# Altium schematic sheet M8_Y-adapter.SchDoc: =project_title
size Tabloid; PageSetup: Record=PageOptions|CenterHorizontal=True|CenterVertical=True|PrintScale=0.73|XCorrection=1.00|YCorrection=1.00|PrintKind=0|BorderSize=5000000|LeftOffset=0|BottomOffset=0|Orientation=2|PaperLength=1000|PaperWidth=1000|Scale=100|PaperSource=7|PrintQuality=-4|MediaType=1|DitherType=10|PaperKind=A4|PrintScaleMode=1; CompanyName: Luxonis Holding; Organization: Luxonis Holding; Address1: 1925 Harmony Park Drive; Address2: Westminster, CO; Address3: 80234; Address4: United States; SheetNumber: 2; SheetTotal: 3
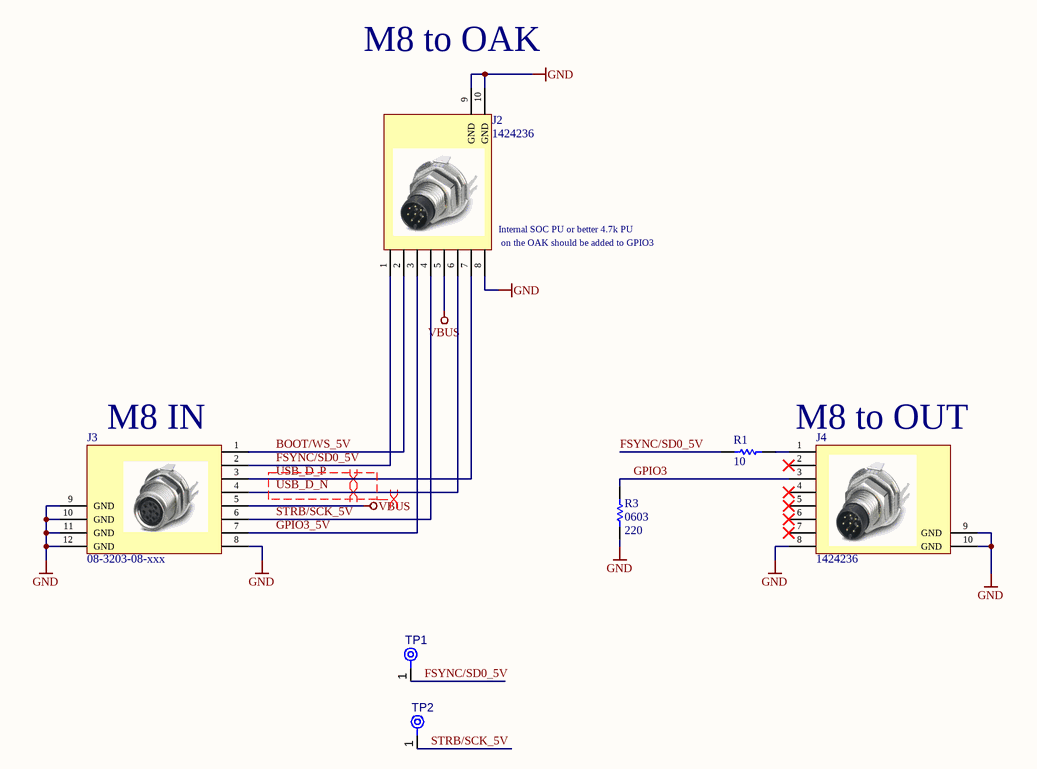
[diagram p0: M8_Y-adapter.SchDoc]

## Parts
J2  1424236  [1424236]
J3  08-3203-08-xxx  [08-3203-08-XXX]
J4  1424236  [1424236]
R1  value 10  [RESC0603(1608)_N]  (hidden comment: CRCW060310R0FKEA)
R3  value 220  Case/Package: 0603  [RESC0603(1608)_L]  (hidden comment: RC0603FR-07220RL)
TP1  TPAD6R  [TP06R]  (value not drawn)  (no BOM)
TP2  TPAD6R  [TP06R]  (value not drawn)  (no BOM)

## Nets
GND: J2.8 J2.9(GND) J2.10(GND) J3.8 J3.9(GND) J3.10(GND) J3.11(GND) J3.12(GND) J4.8 J4.9(GND) J4.10(GND) R3.1
VBUS: J2.5 J3.5
BOOT/WS_5V: J2.2 J3.1
FSYNC/SD0_5V: J2.1 J3.2 R1.1 TP1.1(TP)
GPIO3: J4.3 R3.2
GPIO3_5V: J2.3 J3.7
STRB/SCK_5V: J2.4 J3.6 TP2.1(TP)
USB_D_N: J2.6 J3.4
USB_D_P: J2.7 J3.3
NetJ4_1: J4.1 R1.2

Not connected (* = marked no-connect by the designer): J4 2* 4* 5* 6* 7*

## Layout directives
differential pair: USB_D_N, USB_D_P
rule Matched Net Lengths [Delay Tolerance = 1ps]; net class USB: USB_D_N, USB_D_P

## Notes on the sheet
- M8 to OAK
- (near J2) Internal SOC PU or better 4.7k PU
- (near J2) on the OAK should be added to GPIO3
- (near J3) M8 IN
- (near J4) M8 to OUT
- Title
- Size:
- Date:
- Tabloid
- Number:
- Time:
- Revision:
- Sheet
- of
- Drawn by:

## Library data of the parts
J2 J4 = CMP-002-00173-2: Circular Connector; Manufacturer 1: Phoenix Contact; RoHS: Yes; ComponentLink1URL: https://datasheet.ciiva.com:443/pdfs/VipMasterIC/IC/PCON/PCONS25324/PCONS30824-1.pdf?src-supplier=IHS+Markit; ComponentLink1Description: https://datasheet.ciiva.com:443/pdfs/VipMasterIC/IC/PCON/PCONS25324/PCONS30824-1.pdf?src-supplier=IHS+Markit; RoHS Compliant: Yes; ComponentLink2URL: https://datasheet.ciiva.com/7315/1424236-7315412.pdf?src-supplier=Digi-Key; ComponentLink4URL: https://datasheet.ciiva.com/29258/715201-da-01-en-sens-akt-einbausteck-8pol-1424236-20st-29258298.pdf?src-supplier=Conrad; ComponentLink2Description: https://datasheet.ciiva.com/7315/1424236-7315412.pdf?src-supplier=Digi-Key; Source: NG6013_R3M2E3.SCHLIB; Pricing 1: 1=28,78000, 10=26,47800, 50=24,46320, 100=23,36940 (USD); ComponentLink4Description: https://datasheet.ciiva.com/29258/715201-da-01-en-sens-akt-einbausteck-8pol-1424236-20st-29258298.pdf?src-supplier=Conrad; ComponentLink3URL: https://datasheet.ciiva.com/15197/getdatasheetpartid-694612-15197214.pdf?src-supplier=Verical; Category: Circular Connectors; Design Item ID: 1424236; ComponentLink3Description: https://datasheet.ciiva.com/15197/getdatasheetpartid-694612-15197214.pdf?src-supplier=Verical; Manufacturer Part Number 1: 1424236; REACH SVHC: No SVHC; Connector Type: Circular; Pins: 8; Manufacturer Series: 1424236
J3 = CMP-002-00116-2: M8 Circular Connector; Manufacturer 1: KingTop; Stock 1: 11; Source: NG9097.SchLib; ComponentLink3Description: https://datasheet.ciiva.com/41451/718258-da-01-de-sens-akt-einbaubuch-6pol-1456132-20-st-41451463.pdf?src-supplier=Conrad; Pins: 8; RoHS Compliant: Yes; ComponentLink2Description: https://datasheet.ciiva.com/29221/1456132-29221494.pdf?src-supplier=Digi-Key; REACH SVHC: No SVHC; Contact Finish - Mating: NOT SPECIFIED; Pricing 1: 1=26,56000, 10=24,43500, 50=22,57600, 100=21,51360, 250=20,18568 (USD); Manufacturer Part Number 1: 08-3203-08-XXX; ComponentLink1Description: https://datasheet.ciiva.com:443/pdfs/VipMasterIC/IC/PCON/PCON-S-A0001961096/PCON-S-A0001960825-1.pdf?src-supplier=IHS+Markit; Category: Circular Connectors; ComponentLink1URL: https://datasheet.ciiva.com:443/pdfs/VipMasterIC/IC/PCON/PCON-S-A0001961096/PCON-S-A0001960825-1.pdf?src-supplier=IHS+Markit; RoHS: Yes; ComponentLink2URL: https://datasheet.ciiva.com/29221/1456132-29221494.pdf?src-supplier=Digi-Key; ComponentLink3URL: https://datasheet.ciiva.com/41451/718258-da-01-de-sens-akt-einbaubuch-6pol-1456132-20-st-41451463.pdf?src-supplier=Conrad; Design Item ID: 08-3203-08-xxx; Connector Type: Circular
R1 = CMP-115-000012-5: RES SMD 10 OHM 1% 1/10W 0603; Manufacturer 1: Vishay; Temperature Coefficient: 100ppm/°C; Voltage Rating: 75V; Power Rating: 100mW; Manufacturer Part Number 1: CRCW060310R0FKEA; Min Operating Temperature: -55°C; Case/Package: 0603; Tolerance: 1%; Design Item ID: CRCW060310R0FKEA; Max Operating Temperature: 155°C
R3 = CMP-009-00346-1: RES SMD 220 OHM 1% 0.1W 0603; Manufacturer 1: Yageo; Power Rating: 100mW; Voltage Rating: 75V; Tolerance: 1%; Manufacturer Part Number 1: RC0603FR-07220RL
TP1 TP2 = CMP-00028-00002-3: 0.6mm round; Manufacturer Part Number 1: TPAD6R